# Altium schematic sheet External_Board_2mode.SchDoc: External Board Mode 2 - 1 Wire
size A4; DrawnBy: Anne Moller; Organization: Altium Limited; Address1: L3, 12a Rodborough Rd; Address2: Frenchs Forest; Address3: NSW; Address4: Australia 2086; Revision: 1.0.0; SheetNumber: 1; SheetTotal: 1
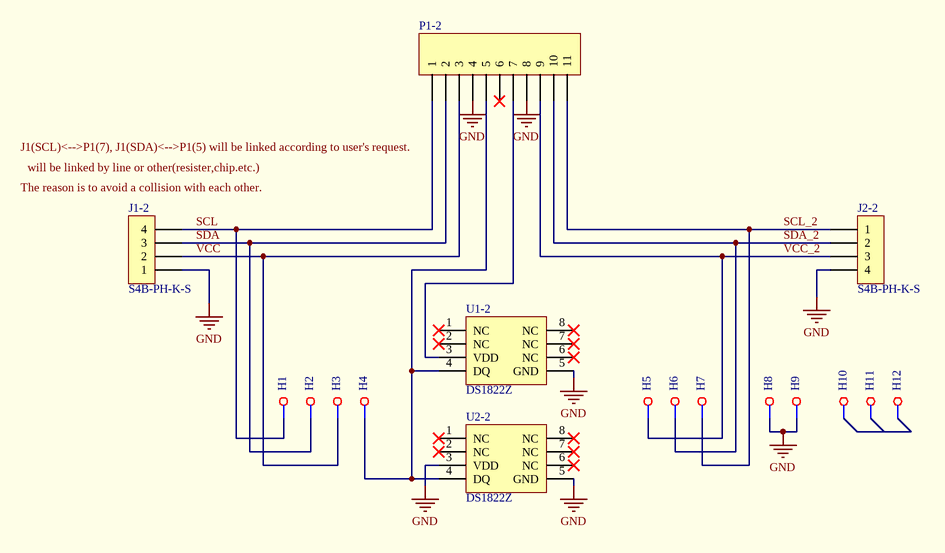
[diagram p0: External_Board_2mode.SchDoc]

## Parts
H1  TP_HOLE  [TestHole]  (value not drawn)
H2  TP_HOLE  [TestHole]  (value not drawn)
H3  TP_HOLE  [TestHole]  (value not drawn)
H4  TP_HOLE  [TestHole]  (value not drawn)
H5  TP_HOLE  [TestHole]  (value not drawn)
H6  TP_HOLE  [TestHole]  (value not drawn)
H7  TP_HOLE  [TestHole]  (value not drawn)
H8  TP_HOLE  [TestHole]  (value not drawn)
H9  TP_HOLE  [TestHole]  (value not drawn)
H10  TP_HOLE  [TestHole]  (value not drawn)
H11  TP_HOLE  [TestHole]  (value not drawn)
H12  TP_HOLE  [TestHole]  (value not drawn)
J1-2  S4B-PH-K-S  [CON4]
J2-2  S4B-PH-K-S  [CON4]
P1-2  Header11  [CON11]  (value not drawn)
U1-2  DS1822Z  [DS1822]
U2-2  DS1822Z  [DS1822]

## Nets
GND: H8.1(TP) H9.1(TP) J1-2.1 J2-2.4 P1-2.4 P1-2.8 U1-2.5(GND) U2-2.3(VDD) U2-2.5(GND)
SCL: H1.1(TP) J1-2.4 P1-2.1
SCL_2: H7.1(TP) J2-2.1 P1-2.11
SDA: H2.1(TP) J1-2.3 P1-2.2
SDA_2: H6.1(TP) J2-2.2 P1-2.10
VCC: H3.1(TP) J1-2.2 P1-2.3
VCC_2: H5.1(TP) J2-2.3 P1-2.9
NetH4_1: H4.1(TP) P1-2.5 U1-2.4(DQ) U2-2.4(DQ)
NetP1-2_7: P1-2.7 U1-2.3(VDD)

Not connected (* = marked no-connect by the designer): H10 1(TP); H11 1(TP); H12 1(TP); P1-2 6*; U1-2 1(NC)* 2(NC)* 6(NC)* 7(NC)* 8(NC)*; U2-2 1(NC)* 2(NC)* 6(NC)* 7(NC)* 8(NC)*

## Notes on the sheet
- Labels drawn without touching a wire or pin: J1(SCL)<-->P1(7), J1(SDA)<-->P1(5) will be linked according to user's request., The reason is to avoid a collision with each other., will be linked by line or other(resister,chip.etc.)
- Title
- Size:
- Date:
- A4
- Number:
- Time:
- Revision:
- Sheet
- of
- Drawn by:
- File:

## Library data of the parts
H1-H12 = TP_HOLE: TEST POINT HOLE
J1-2 J2-2 = S4B-PH-K-S (LF)(SN): JST (JAPAN SOLDERLESS TERMINALS) - S4B-PH-K-S (LF)(SN) - CONNECTOR, HEADER, 2MM, 4 POSITION, 1ROW; Supplier 1: Newark; Manufacturer: JST (JAPAN SOLDERLESS TERMINALS); Manufacturer Part Number: S4B-PH-K-S (LF)(SN); RoHS: YES; Stock 1: 908; Pricing 1: 1=0.14, 250=0.126, 500=0.112, 1000=0.101, 5000=0.069 (USD); ComponentLink1URL: http://www.farnell.com/datasheets/80564.pdf; ComponentLink1Description: http://www.farnell.com/datasheets/80564.pdf
P1-2 = SFH11-PBPC-D10-ST-BK: CONN HEADR FMALE 20POS .1" DL AU; Manufacturer: Sullins Connector Solutions; Connector Type: Header; Number of Positions: 20; Number of Positions Loaded: All; Pitch: 0.100" (2.54mm); Supplier 1: Digi-Key; Manufacturer Part Number: SFH11-PBPC-D10-ST-BK; RoHS: RoHS Compliant; Category: Connectors, Interconnects; Stock 1: 14457; Pricing 1: 1=1.43, 10=1.185, 25=1.0976, 50=0.9878, 100=0.878, 250=0.76824, 500=0.7024, 1000=0.63655, 2500=0.5707 (USD); Packaging: Tray; Contact Type: Female Socket; Number of Rows: 2; Row Spacing: 0.100" (2.54mm); Mounting Type: Through Hole; Termination: Solder; Fastening Type: -; Features: Polarizing Key; Contact Finish: Gold; Contact Finish Thickness: Flash; Color: Black; ComponentLink1URL: http://sullinscorp.com/catalogs/146_PAGE119_.100_SFH11_SERIES_FEMALE_HDR_ST_RA.pdf; ComponentLink1Description: http://sullinscorp.com/catalogs/146_PAGE119_.100_SFH11_SERIES_FEMALE_HDR_ST_RA.pdf
U1-2 U2-2 = DS1822Z+: SENSOR TEMPERATURE 1-WIRE 8SOIC; Manufacturer: Maxim Integrated; Sensor Type: Digital, Local; Sensing Temperature - Local: -55°C ~ 125°C; Output Type: 1-Wire®; Voltage - Supply: 3 V ~ 5.5 V; Resolution: 11 b; Accuracy - Highest (Lowest): ±2°C (±3°C); Test Condition: -10°C ~ 85°C (-55°C ~ 125°C); Supplier 1: Digi-Key; Manufacturer Part Number: DS1822Z+; RoHS: RoHS Compliant; Category: Sensors, Transducers; Stock 1: 1532; Pricing 1: 1=2.4, 10=2.321 (USD); Packaging: Tube; Sensing Temperature - Remote: -; Features: Output Switch, Programmable Limit, Standby Mode; Operating Temperature: -55°C ~ 125°C; Package / Case: 8-SOIC (0.154", 3.90mm Width); Supplier Device Package: 8-SOIC; ComponentLink1URL: http://datasheets.maximintegrated.com/en/ds/DS1822.pdf; ComponentLink1Description: http://datasheets.maximintegrated.com/en/ds/DS1822.pdf; Supplier 2: Digi-Key; Stock 2: 5995; Pricing 2: 1=2.14, 10=2.015, 25=1.6116, 50=1.531, 100=1.4102, 250=1.33764, 500=1.28928 (USD); ComponentLink2URL: http://datasheets.maximintegrated.com/en/ds/DS1775-DS1775R.pdf; ComponentLink2Description: http://datasheets.maximintegrated.com/en/ds/DS1775-DS1775R.pdf